# EAGLE design analog_out (EAGLE 9.6.1)
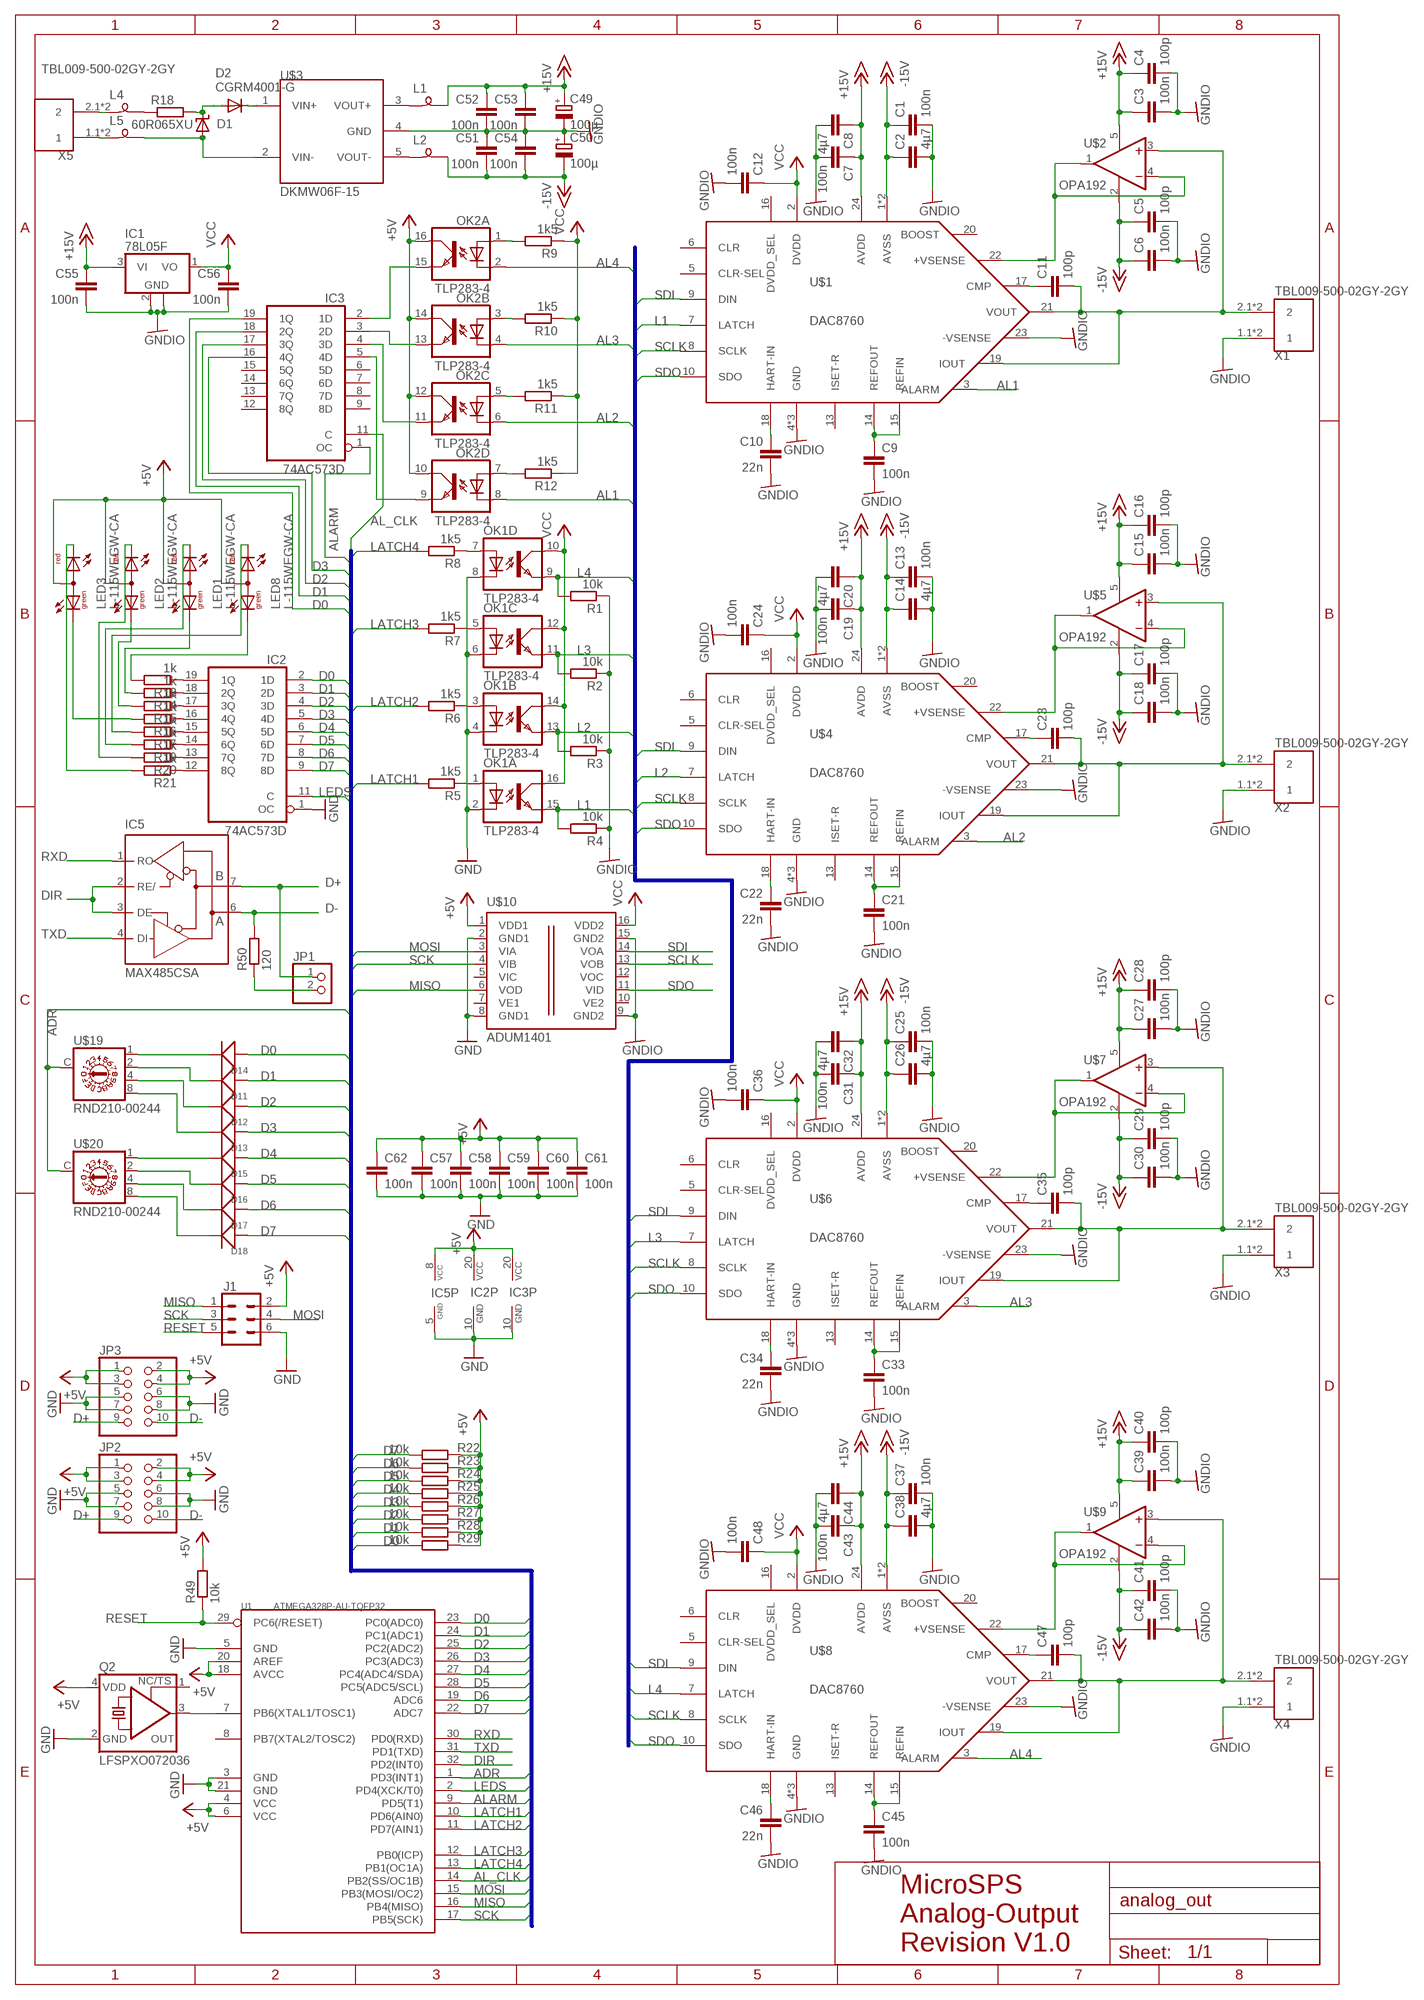
[diagram p0: schematic, sheet 1]

## Parts
C1  100n  C-EUC0805  [C0805]
C2  4µ7  C-EUC0805  [C0805]
C3  100n  C-EUC0805  [C0805]
C4  100p  C-EUC0805  [C0805]
C5  100p  C-EUC0805  [C0805]
C6  100n  C-EUC0805  [C0805]
C7  100n  C-EUC0805  [C0805]
C8  4µ7  C-EUC0805  [C0805]
C9  100n  C-EUC0805  [C0805]
C10  22n  C-EUC0805  [C0805]
C11  100p  C-EUC0805  [C0805]
C12  100n  C-EUC0805  [C0805]
C13  100n  C-EUC0805  [C0805]
C14  4µ7  C-EUC0805  [C0805]
C15  100n  C-EUC0805  [C0805]
C16  100p  C-EUC0805  [C0805]
C17  100p  C-EUC0805  [C0805]
C18  100n  C-EUC0805  [C0805]
C19  100n  C-EUC0805  [C0805]
C20  4µ7  C-EUC0805  [C0805]
C21  100n  C-EUC0805  [C0805]
C22  22n  C-EUC0805  [C0805]
C23  100p  C-EUC0805  [C0805]
C24  100n  C-EUC0805  [C0805]
C25  100n  C-EUC0805  [C0805]
C26  4µ7  C-EUC0805  [C0805]
C27  100n  C-EUC0805  [C0805]
C28  100p  C-EUC0805  [C0805]
C29  100p  C-EUC0805  [C0805]
C30  100n  C-EUC0805  [C0805]
C31  100n  C-EUC0805  [C0805]
C32  4µ7  C-EUC0805  [C0805]
C33  100n  C-EUC0805  [C0805]
C34  22n  C-EUC0805  [C0805]
C35  100p  C-EUC0805  [C0805]
C36  100n  C-EUC0805  [C0805]
C37  100n  C-EUC0805  [C0805]
C38  4µ7  C-EUC0805  [C0805]
C39  100n  C-EUC0805  [C0805]
C40  100p  C-EUC0805  [C0805]
C41  100p  C-EUC0805  [C0805]
C42  100n  C-EUC0805  [C0805]
C43  100n  C-EUC0805  [C0805]
C44  4µ7  C-EUC0805  [C0805]
C45  100n  C-EUC0805  [C0805]
C46  22n  C-EUC0805  [C0805]
C47  100p  C-EUC0805  [C0805]
C48  100n  C-EUC0805  [C0805]
C49  100µ  CPOL-EU153CLV-0505  [153CLV-0505]
C50  100µ  CPOL-EU153CLV-0505  [153CLV-0505]
C51  100n  C-EUC0805  [C0805]
C52  100n  C-EUC0805  [C0805]
C53  100n  C-EUC0805  [C0805]
C54  100n  C-EUC0805  [C0805]
C55  100n  C-EUC0805  [C0805]
C56  100n  C-EUC0805  [C0805]
C57  100n  C-EUC0805  [C0805]
C58  100n  C-EUC0805  [C0805]
C59  100n  C-EUC0805  [C0805]
C60  100n  C-EUC0805  [C0805]
C61  100n  C-EUC0805  [C0805]
C62  100n  C-EUC0805  [C0805]
D1  SUPPRESSOR-SMBJ  [SMBJ]
D2  CGRM4001-G  [SOD-123_MINI-SMA]
D11  DIODE'1N4148-SMD'  [LL-34]
D12  DIODE'1N4148-SMD'  [LL-34]
D13  DIODE'1N4148-SMD'  [LL-34]
D14  DIODE'1N4148-SMD'  [LL-34]
D15  DIODE'1N4148-SMD'  [LL-34]
D16  DIODE'1N4148-SMD'  [LL-34]
D17  DIODE'1N4148-SMD'  [LL-34]
D18  DIODE'1N4148-SMD'  [LL-34]
IC1  78L05F  [SOT89]
IC2  74AC573D  [SO20W]
IC3  74AC573D  [SO20W]
IC5  MAX485CSA  MAX481CSA  [SO08]
J1  CONN_03X2FEMALE_SMD  [2X3_SMD]
JP1  PINHD-1X2  [1X02]
JP2  PINHD-2X5/90  [2X05/90]
JP3  PINHD-2X5/90  [2X05/90]
L1  SM-B5  [SM-B5]
L2  SM-B5  [SM-B5]
L4  SM-B5  [SM-B5]
L5  SM-B5  [SM-B5]
LED1  L-115WEGW-CA  [DUOLED-A-3MM]
LED2  L-115WEGW-CA  [DUOLED-A-3MM]
LED3  L-115WEGW-CA  [DUOLED-A-3MM]
LED8  L-115WEGW-CA  [DUOLED-A-3MM]
OK1  TLP283-4  [MINI-FLAT-16]
OK2  TLP283-4  [MINI-FLAT-16]
Q2  LFSPXO072036  KXO-PXO/XO-56-56  [5.0X3.2_KXO-56]
R1  10k  R-EU_R0805  [R0805]
R2  10k  R-EU_R0805  [R0805]
R3  10k  R-EU_R0805  [R0805]
R4  10k  R-EU_R0805  [R0805]
R5  1k5  R-EU_R0805  [R0805]
R6  1k5  R-EU_R0805  [R0805]
R7  1k5  R-EU_R0805  [R0805]
R8  1k5  R-EU_R0805  [R0805]
R9  1k5  R-EU_R0805  [R0805]
R10  1k5  R-EU_R0805  [R0805]
R11  1k5  R-EU_R0805  [R0805]
R12  1k5  R-EU_R0805  [R0805]
R13  1k  R-EU_R0805  [R0805]
R14  1k  R-EU_R0805  [R0805]
R15  1k  R-EU_R0805  [R0805]
R16  1k  R-EU_R0805  [R0805]
R17  1k  R-EU_R0805  [R0805]
R18  60R065XU  R-EU_0204/5  [0204/5]
R19  1k  R-EU_R0805  [R0805]
R20  1k  R-EU_R0805  [R0805]
R21  1k  R-EU_R0805  [R0805]
R22  10k  R-EU_R0805  [R0805]
R23  10k  R-EU_R0805  [R0805]
R24  10k  R-EU_R0805  [R0805]
R25  10k  R-EU_R0805  [R0805]
R26  10k  R-EU_R0805  [R0805]
R27  10k  R-EU_R0805  [R0805]
R28  10k  R-EU_R0805  [R0805]
R29  10k  R-EU_R0805  [R0805]
R49  10k  R-EU_R0805  [R0805]
R50  120  R-EU_R0805  [R0805]
U1  ATMEGA328P-AU-TQFP32  MCU-ATMEGA328P-AU(TQFP32)  [TQFP32-0.8-7X7MM]
U$1  DAC8760  [HTSSOP24PWP]
U$2  OPA192  [SOT23-DBV]
U$3  DKMW06F-15  [DKWM06]
U$4  DAC8760  [HTSSOP24PWP]
U$5  OPA192  [SOT23-DBV]
U$6  DAC8760  [HTSSOP24PWP]
U$7  OPA192  [SOT23-DBV]
U$8  DAC8760  [HTSSOP24PWP]
U$9  OPA192  [SOT23-DBV]
U$10  ADUM1401  [SO-16W]
U$19  RND210-00244  [RND210-00244]
U$20  RND210-00244  [RND210-00244]
X1  TBL009-500-02GY-2GY  [TBL009-500-02GY-2GY]
X2  TBL009-500-02GY-2GY  [TBL009-500-02GY-2GY]
X3  TBL009-500-02GY-2GY  [TBL009-500-02GY-2GY]
X4  TBL009-500-02GY-2GY  [TBL009-500-02GY-2GY]
X5  TBL009-500-02GY-2GY  [TBL009-500-02GY-2GY]

## Nets
+5V: C57.1 C58.1 C59.1 C60.1 C61.1 C62.1 IC2.20(VCC) IC3.20(VCC) IC5.8(VCC) J1.2 JP2.1 JP2.2 JP2.3 JP2.4 JP3.1 JP3.2 JP3.3 JP3.4 LED1.2(A) LED2.2(A) LED3.2(A) LED8.2(A) OK2.10(D:COL) OK2.12(C:COL) OK2.14(B:COL) OK2.16(A:COL) Q2.4(VDD) R22.1 R23.1 R24.1 R25.1 R26.1 R27.1 R28.1 R29.1 R49.2 U1.4(VCC) U1.6(VCC) U1.18(AVCC) U1.20(AREF) U$10.1(VDD1)
+15V: C3.1 C4.1 C7.1 C8.1 C15.1 C16.1 C19.1 C20.1 C27.1 C28.1 C31.1 C32.1 C39.1 C40.1 C43.1 C44.1 C49.+ C52.1 C53.1 C55.1 IC1.3(VI) L1.1 U$1.24(AVDD) U$2.5(V+) U$4.24(AVDD) U$5.5(V+) U$6.24(AVDD) U$7.5(V+) U$8.24(AVDD) U$9.5(V+)
-15V: C1.1 C2.1 C5.1 C6.1 C13.1 C14.1 C17.1 C18.1 C25.1 C26.1 C29.1 C30.1 C37.1 C38.1 C41.1 C42.1 C50.- C51.2 C54.2 L2.1 U$1.1(AVSS) U$1.EXP(AVSS) U$2.2(V-) U$4.1(AVSS) U$4.EXP(AVSS) U$5.2(V-) U$6.1(AVSS) U$6.EXP(AVSS) U$7.2(V-) U$8.1(AVSS) U$8.EXP(AVSS) U$9.2(V-)
ADR: U1.1(PD3(INT1)) U$19.C U$20.C
AL1: OK2.8(D:C) U$1.3(ALARM)
AL2: OK2.6(C:C) U$4.3(ALARM)
AL3: OK2.4(B:C) U$6.3(ALARM)
AL4: OK2.2(A:C) U$8.3(ALARM)
AL_CLK: IC3.11(C) U1.14(PB2(SS/OC1B))
ALARM: IC3.1(OC) U1.9(PD5(T1))
D0: D14.A(+) IC2.2(1D) IC3.19(1Q) R29.2 U1.23(PC0(ADC0))
D1: D11.A(+) IC2.3(2D) IC3.18(2Q) R28.2 U1.24(PC1(ADC1))
D2: D12.A(+) IC2.4(3D) IC3.17(3Q) R27.2 U1.25(PC2(ADC2))
D3: D13.A(+) IC2.5(4D) IC3.16(4Q) R26.2 U1.26(PC3(ADC3))
D4: D15.A(+) IC2.6(5D) R25.2 U1.27(PC4(ADC4/SDA))
D5: D16.A(+) IC2.7(6D) R24.2 U1.28(PC5(ADC5/SCL))
D6: D17.A(+) IC2.8(7D) R23.2 U1.19(ADC6)
D7: D18.A(+) IC2.9(8D) R22.2 U1.22(ADC7)
D+: IC5.7(B) JP1.1 JP2.9 JP3.9
D-: IC5.6(A) JP2.10 JP3.10 R50.2
DIR: IC5.2(RE/) IC5.3(DE) U1.32(PD2(INT0))
GND: C57.2 C58.2 C59.2 C60.2 C61.2 C62.2 IC2.1(OC) IC2.10(GND) IC3.10(GND) IC5.5(GND) J1.6 JP2.5 JP2.6 JP2.7 JP2.8 JP3.5 JP3.6 JP3.7 JP3.8 OK1.2(A:C) OK1.4(B:C) OK1.6(C:C) OK1.8(D:C) Q2.2(GND) U1.3(GND) U1.5(GND) U1.21(GND) U$10.2(GND1) U$10.8(GND1)
GNDIO: C1.2 C2.2 C3.2 C4.2 C5.2 C6.2 C7.2 C8.2 C9.2 C10.2 C12.2 C13.2 C14.2 C15.2 C16.2 C17.2 C18.2 C19.2 C20.2 C21.2 C22.2 C24.2 C25.2 C26.2 C27.2 C28.2 C29.2 C30.2 C31.2 C32.2 C33.2 C34.2 C36.2 C37.2 C38.2 C39.2 C40.2 C41.2 C42.2 C43.2 C44.2 C45.2 C46.2 C48.2 C49.- C50.+ C51.1 C52.2 C53.2 C54.1 C55.2 C56.2 IC1.2(GND) IC1.2@1(GND) R1.1 R2.1 R3.1 R4.1 U$1.4(GND) U$1.11(GND) U$1.12(GND) U$1.23(-VSENSE) U$3.4(GND) U$4.4(GND) U$4.11(GND) U$4.12(GND) U$4.23(-VSENSE) U$6.4(GND) U$6.11(GND) U$6.12(GND) U$6.23(-VSENSE) U$8.4(GND) U$8.11(GND) U$8.12(GND) U$8.23(-VSENSE) U$10.9(GND2) U$10.15(GND2) X1.1.1 X1.1.2 X2.1.1 X2.1.2 X3.1.1 X3.1.2 X4.1.1 X4.1.2
L1: OK1.15(A:EMIT) R4.2 U$1.7(LATCH)
L2: OK1.13(B:EMIT) R3.2 U$4.7(LATCH)
L3: OK1.11(C:EMIT) R2.2 U$6.7(LATCH)
L4: OK1.9(D:EMIT) R1.2 U$8.7(LATCH)
LATCH1: R5.2 U1.10(PD6(AIN0))
LATCH2: R6.2 U1.11(PD7(AIN1))
LATCH3: R7.2 U1.12(PB0(ICP))
LATCH4: R8.2 U1.13(PB1(OC1A))
LEDS: IC2.11(C) U1.2(PD4(XCK/T0))
MISO: J1.1 U1.16(PB4(MISO)) U$10.6(VOD)
MOSI: J1.4 U1.15(PB3(MOSI/OC2)) U$10.3(VIA)
N$1: C9.1 U$1.14(REFOUT) U$1.15(REFIN)
N$2: C10.1 U$1.18(HART-IN)
N$3: C11.1 U$1.17(CMP)
N$4: C23.2 U$4.19(IOUT) U$4.21(VOUT) U$5.3(+IN) X2.2.1 X2.2.2
N$5: C11.2 U$1.19(IOUT) U$1.21(VOUT) U$2.3(+IN) X1.2.1 X1.2.2
N$6: U$1.22(+VSENSE) U$2.1(OUT) U$2.4(-IN)
N$7: U$4.22(+VSENSE) U$5.1(OUT) U$5.4(-IN)
N$8: C21.1 U$4.14(REFOUT) U$4.15(REFIN)
N$9: C22.1 U$4.18(HART-IN)
N$10: C23.1 U$4.17(CMP)
N$11: C35.2 U$6.19(IOUT) U$6.21(VOUT) U$7.3(+IN) X3.2.1 X3.2.2
N$12: U$6.22(+VSENSE) U$7.1(OUT) U$7.4(-IN)
N$13: C33.1 U$6.14(REFOUT) U$6.15(REFIN)
N$14: C34.1 U$6.18(HART-IN)
N$15: C35.1 U$6.17(CMP)
N$16: C47.2 U$8.19(IOUT) U$8.21(VOUT) U$9.3(+IN) X4.2.1 X4.2.2
N$17: U$8.22(+VSENSE) U$9.1(OUT) U$9.4(-IN)
N$18: C45.1 U$8.14(REFOUT) U$8.15(REFIN)
N$19: C46.1 U$8.18(HART-IN)
N$20: C47.1 U$8.17(CMP)
N$21: L4.2 X5.2.1 X5.2.2
N$22: L5.2 X5.1.1 X5.1.2
N$23: L4.1 R18.1
N$24: D1.C D2.A R18.2
N$25: D1.A L5.1 U$3.2(VIN-)
N$26: D2.C U$3.1(VIN+)
N$27: L1.2 U$3.3(VOUT+)
N$28: L2.2 U$3.5(VOUT-)
N$29: IC2.19(1Q) R13.1
N$30: IC2.18(2Q) R14.1
N$31: IC2.17(3Q) R15.1
N$32: IC2.16(4Q) R16.1
N$33: OK2.1(A:A) R9.2
N$34: OK1.1(A:A) R5.1
N$35: OK1.3(B:A) R6.1
N$36: OK1.5(C:A) R7.1
N$37: OK1.7(D:A) R8.1
N$38: OK2.3(B:A) R10.2
N$39: OK2.5(C:A) R11.2
N$40: OK2.7(D:A) R12.2
N$41: IC2.15(5Q) R17.1
N$42: IC2.14(6Q) R19.1
N$43: IC2.13(7Q) R20.1
N$44: IC2.12(8Q) R21.1
N$45: LED8.1(CG) R13.2
N$46: LED1.1(CG) R14.2
N$47: LED2.1(CG) R15.2
N$48: LED3.1(CG) R16.2
N$49: LED8.3(CR) R17.2
N$50: LED1.3(CR) R19.2
N$51: LED2.3(CR) R20.2
N$52: LED3.3(CR) R21.2
N$53: IC3.5(4D) OK2.9(D:EMIT)
N$54: IC3.4(3D) OK2.11(C:EMIT)
N$55: IC3.3(2D) OK2.13(B:EMIT)
N$56: IC3.2(1D) OK2.15(A:EMIT)
N$97: Q2.3(OUT) U1.7(PB6(XTAL1/TOSC1))
N$99: JP1.2 R50.1
N$100: D14.C(-) U$19.1
N$101: D11.C(-) U$19.2
N$102: D12.C(-) U$19.4
N$103: D13.C(-) U$19.8
N$104: D15.C(-) U$20.1
N$105: D16.C(-) U$20.2
N$106: D17.C(-) U$20.4
N$107: D18.C(-) U$20.8
RESET: J1.5 R49.1 U1.29(PC6(/RESET))
RXD: IC5.1(RO) U1.30(PD0(RXD))
SCK: J1.3 U1.17(PB5(SCK)) U$10.4(VIB)
SCLK: U$1.8(SCLK) U$4.8(SCLK) U$6.8(SCLK) U$8.8(SCLK) U$10.13(VOB)
SDI: U$1.9(DIN) U$4.9(DIN) U$6.9(DIN) U$8.9(DIN) U$10.14(VOA)
SDO: U$1.10(SDO) U$4.10(SDO) U$6.10(SDO) U$8.10(SDO) U$10.11(VID)
TXD: IC5.4(DI) U1.31(PD1(TXD))
VCC: C12.1 C24.1 C36.1 C48.1 C56.1 IC1.1(VO) OK1.10(D:COL) OK1.12(C:COL) OK1.14(B:COL) OK1.16(A:COL) R9.1 R10.1 R11.1 R12.1 U$1.2(DVDD) U$4.2(DVDD) U$6.2(DVDD) U$8.2(DVDD) U$10.16(VDD2)
Unconnected: IC3.6(5D) IC3.7(6D) IC3.8(7D) IC3.9(8D) IC3.12(8Q) IC3.13(7Q) IC3.14(6Q) IC3.15(5Q) Q2.1(TS) U1.8(PB7(XTAL2/TOSC2)) U$1.5(CLR-SEL) U$1.6(CLR) U$1.13(ISET-R) U$1.16(DVDD_SEL) U$1.20(BOOST) U$4.5(CLR-SEL) U$4.6(CLR) U$4.13(ISET-R) U$4.16(DVDD_SEL) U$4.20(BOOST) U$6.5(CLR-SEL) U$6.6(CLR) U$6.13(ISET-R) U$6.16(DVDD_SEL) U$6.20(BOOST) U$8.5(CLR-SEL) U$8.6(CLR) U$8.13(ISET-R) U$8.16(DVDD_SEL) U$8.20(BOOST) U$10.5(VIC) U$10.7(VE1) U$10.10(VE2) U$10.12(VOC)

## Buses
ADR,ALARM,AL_CLK,D0,D1,D2,D3,D4,D5,D6,D7,LATCH1,LATCH2,LATCH3,LATCH4,LEDS,MISO,MOSI,SCK
AL1,AL2,AL3,AL4,L1,L2,L3,L4,SCLK,SDI,SDO

## Notes on the sheet
- MicroSPS
  Analog-Output
  Revision V1.0

## Library data of the parts
C1-C48 C51-C62 = rcl:C-EU: CAPACITOR, European symbol; SPICEPREFIX: C
C49 C50 = rcl:CPOL-EU: POLARIZED CAPACITOR, European symbol; SPICEPREFIX: C
D1 = diode:SUPPRESSOR-: Suppressor diode
D2 = diode:CGRM400*-G: Molded plasitc,JEDEC SOD-123/Mini SMA Source: Comchip CGRM4001-G.pdf
D11-D18 = Seeed-OPL-Diode:DIODE*
IC1 = linear:78L*: POSITOIV-VOLTAGE REGULATORS Output up to 100 mA Source: Datasheet <http://focus.ti.com/lit/ds/symlink/ua78l05.pdf>
IC2 IC3 = 74xx-eu:74*573: 8-bit D latch BUS DRIVER
IC5 = maxim:MAX481CSA: RS485 TRANSEIVER; MF: MAXIM; MPN: MAX481CSA; OC_FARNELL: unknown; OC_NEWARK: 90C3817
J1 = SparkFun-Connectors:CONN_03X2: Multi connection point. Often used as Generic Header-pin footprint for 0.1 inch spaced/style header connections You can populate with any combo of single row headers, but if you'd like an exact match, check these: Header - 2x3 (Male, 0.1") <https://www.sparkfun.com/products/12807> (PRT-12807) Header - 2x3 (Female, 0.1") <https://www.sparkfun.com/products/13010> (PRT-13010) 2x3 Pin Shrouded Header <https://www.sparkfun.com/products/10877> (PRT-10877) On any of the 0.1 inch spaced packages, you can populate with these: Break Away Headers - Straight <https://www.sparkfun.com/products/116> (PRT-00116) Break Away Male Headers - Right Angle <https://www.sparkfun.com/products/553> (PRT-00553) Female Headers <https://www.sparkfun.com/products/115> (PRT-00115) Break Away Headers - Machine Pin <https://www.sparkfun.com/products/117> (PRT-00117) Break Away Female Headers - Swiss Machine Pin <https://www.sparkfun.com/products/743> (PRT-00743) Special note: the shrouded connector mates well with our 3x2 ribbon cables: Ribbon Crimp Connector - 6-pin (2x3, Female) <https://www.sparkfun.com/products/10651> (PRT-10651) Ribbon Cable - 6 wire (15ft) <https://www.sparkfun.com/products/10646> (PRT-10646); PROD_ID: CONN-11290
JP1 = pinhead:PINHD-1X2: PIN HEADER
JP2 JP3 = pinhead:PINHD-2X5: PIN HEADER
L1 L2 L4 L5 = inductor-neosid:SM-B: INDUCTOR SMD Bead inductor; OC_FARNELL: unknown; OC_NEWARK: unknown
LED1-LED3 LED8 = led:L-115WEGW-CA: T-1(3mm) BI-COLOR INDICATOR LAMP Source: Kingbright .. 2_colour_led_.pdf
OK1 OK2 = optocoupler:TLP283-4: TOSHIBA PHOTOCOUPLER GaAs IRED & PHOTO-TRANSISTOR Source: http://www.semicon.toshiba.co.jp/td/en/Opto/Photocoupler/en_20050928_TLP283_datasheet.pdf; OC_FARNELL: unknown; OC_NEWARK: unknown
Q2 = crystal-geyer_V1_0:KXO-PXO/XO-56: SSO Spread Spectrum Oscillator (PXO/XO) MHz : KXO - Serie Model Size l/w/h [mm] Frequency Range Frequency Stability Temp. Range [°C] Output AECQ 200 availabel Datasheet KXO-56 5.0/3.2/1.2 1,0 ~ 134,0 MHz ±25 … ±100ppm (*) -40°C …+85°C HCMOS - KXO-56.pdf <http://www.geyer-electronic.de/uploads/tx_userartikelfrequenz/GEYER-KXO-56.pdf> <http://www.geyer-electronic.de/fileadmin/template/img/logo-geyer-electronic.png> Details see: http://www.geyer-electronic.de/Frequenz-Produkte.9.0.html Created 2016-06-07, Hans Locher 2016 (C) Geyer Quartz Technology KXO56;5,0x3,2;5.0x3.2;5032
R1-R29 R49 R50 = rcl:R-EU_: RESISTOR, European symbol; SPICEPREFIX: R
U1 = Seeed-OPL-ic:MCU-ATMEGA328P-AU(TQFP32): 310010049; MPN: ATMEGA328P-AU
U$1 U$4 U$6 U$8 = texas:DAC8760
U$2 U$5 U$7 U$9 = texas:OPA192
U$3 = meanwell:DKMW06F-15
U$10 = analog-devices:ADUM1401
U$19 U$20 = switch-dil:RND210-00244
X1-X5 = con-phoenix-500:TBL009-500-02GY-2GY

## Board
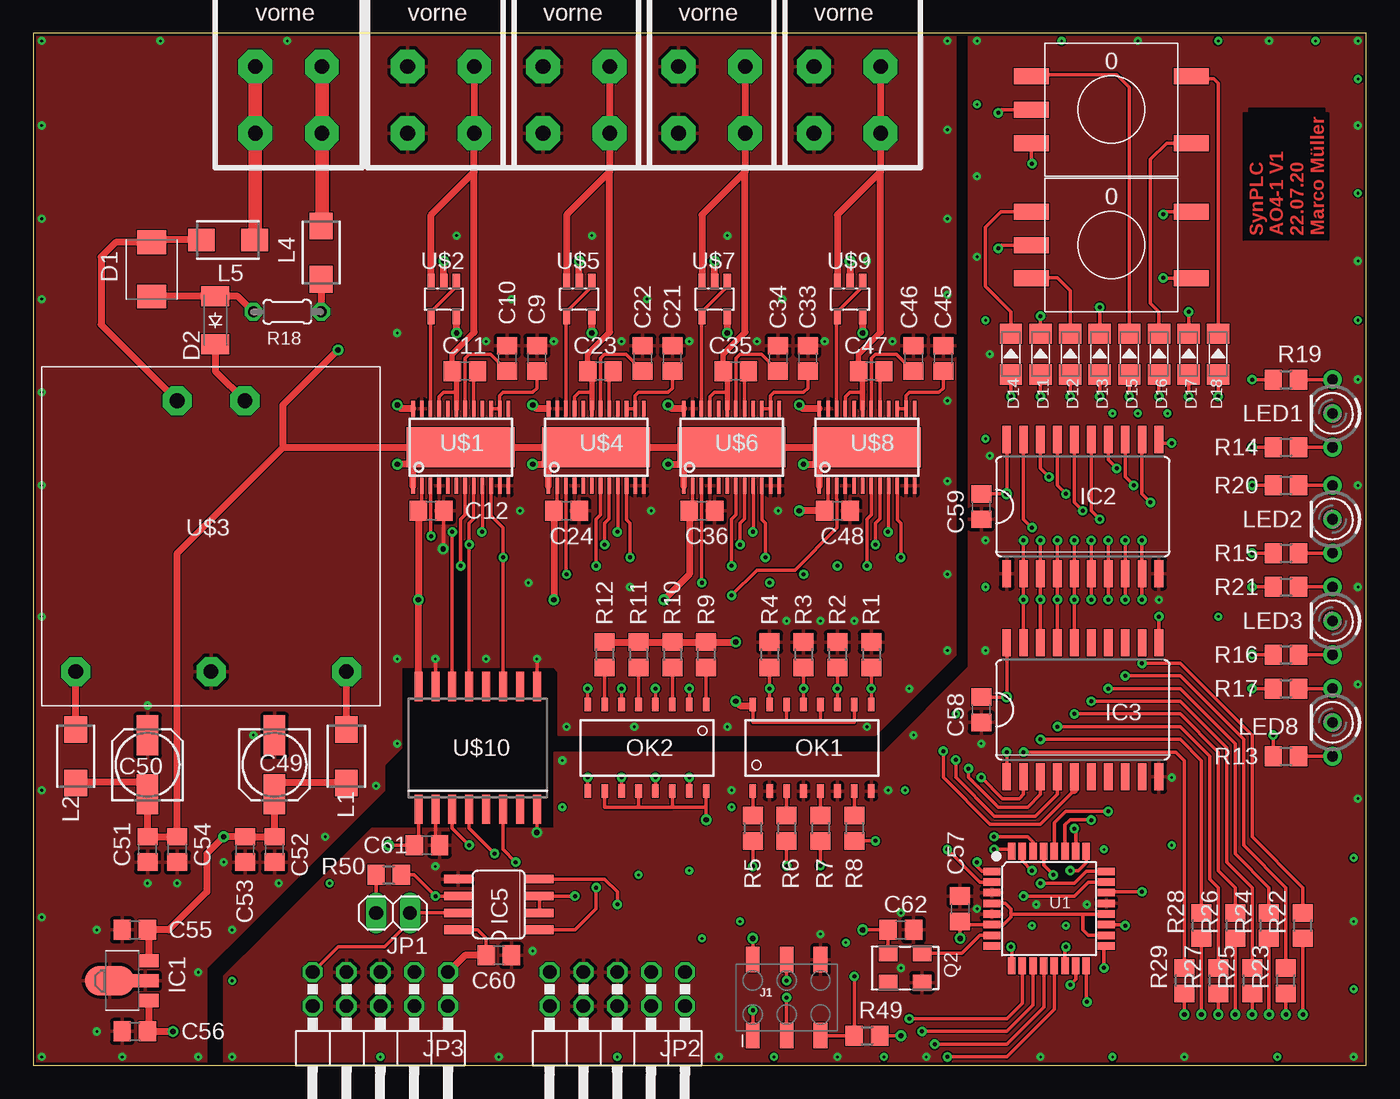
[diagram p1: board, top side]
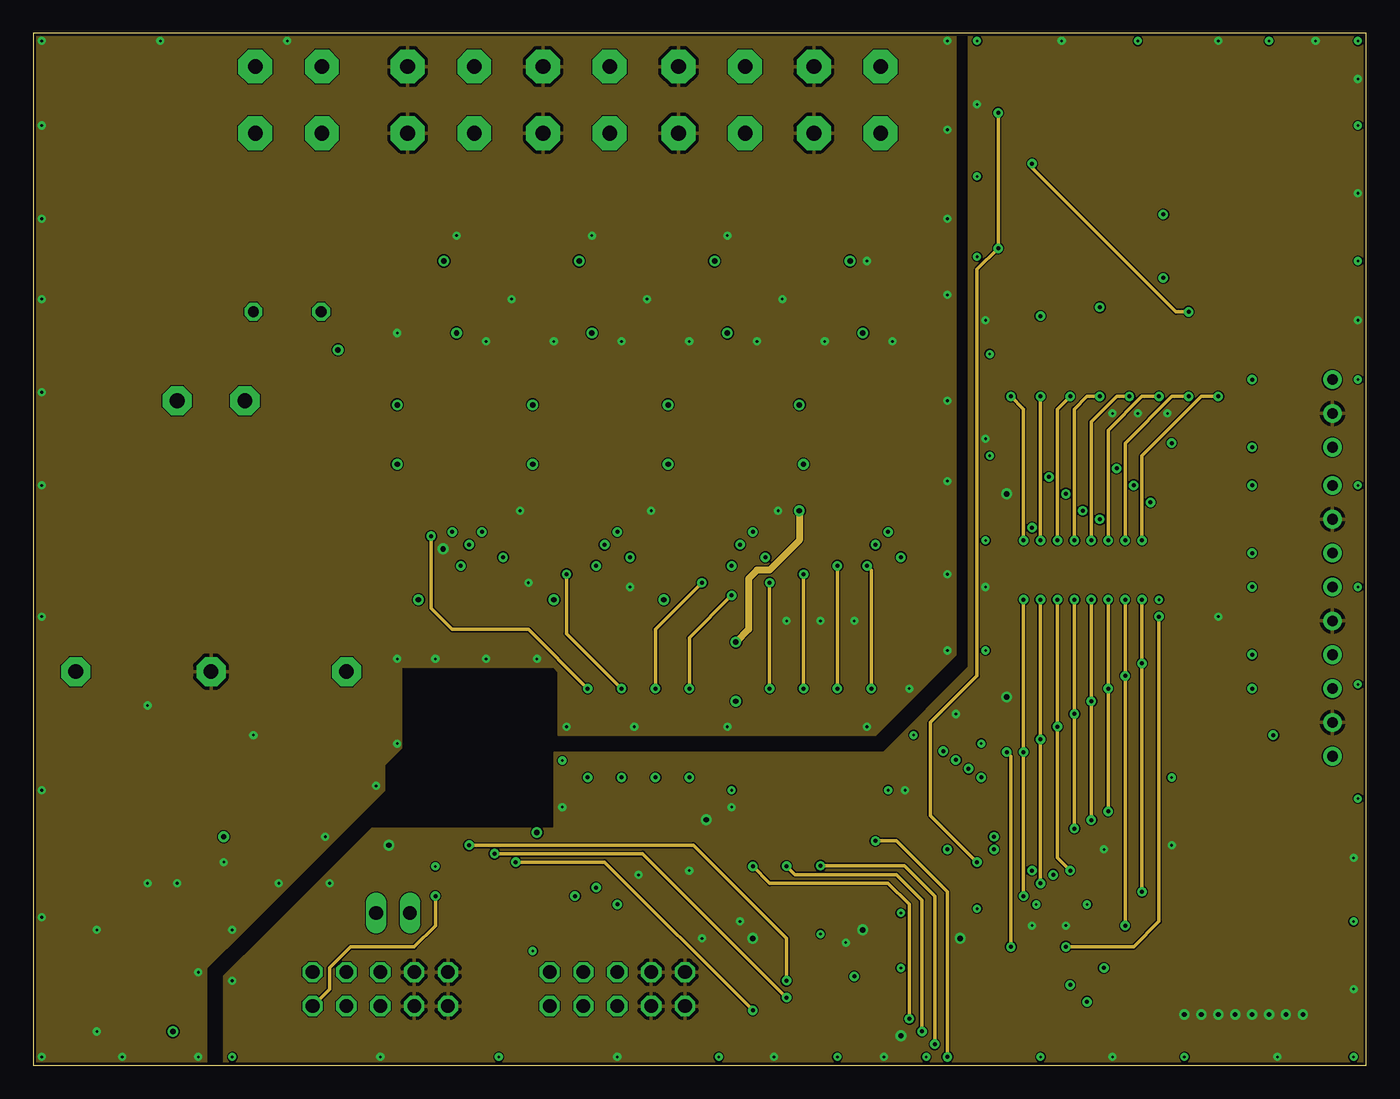
[diagram p2: board, inner layer Route2]
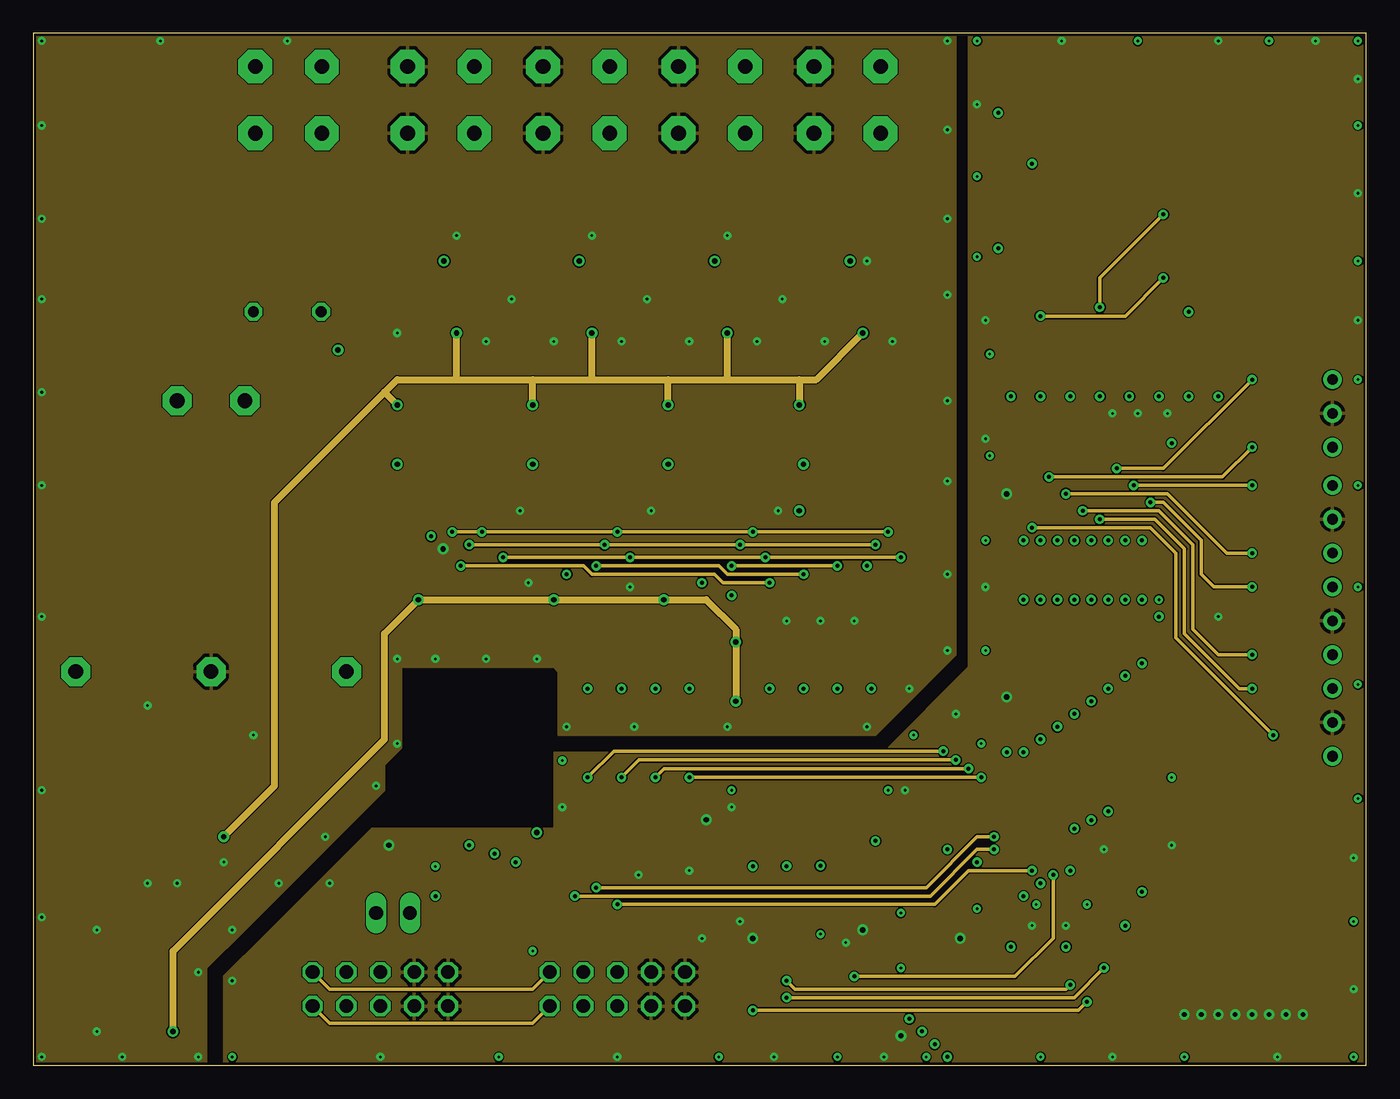
[diagram p3: board, inner layer Route15]
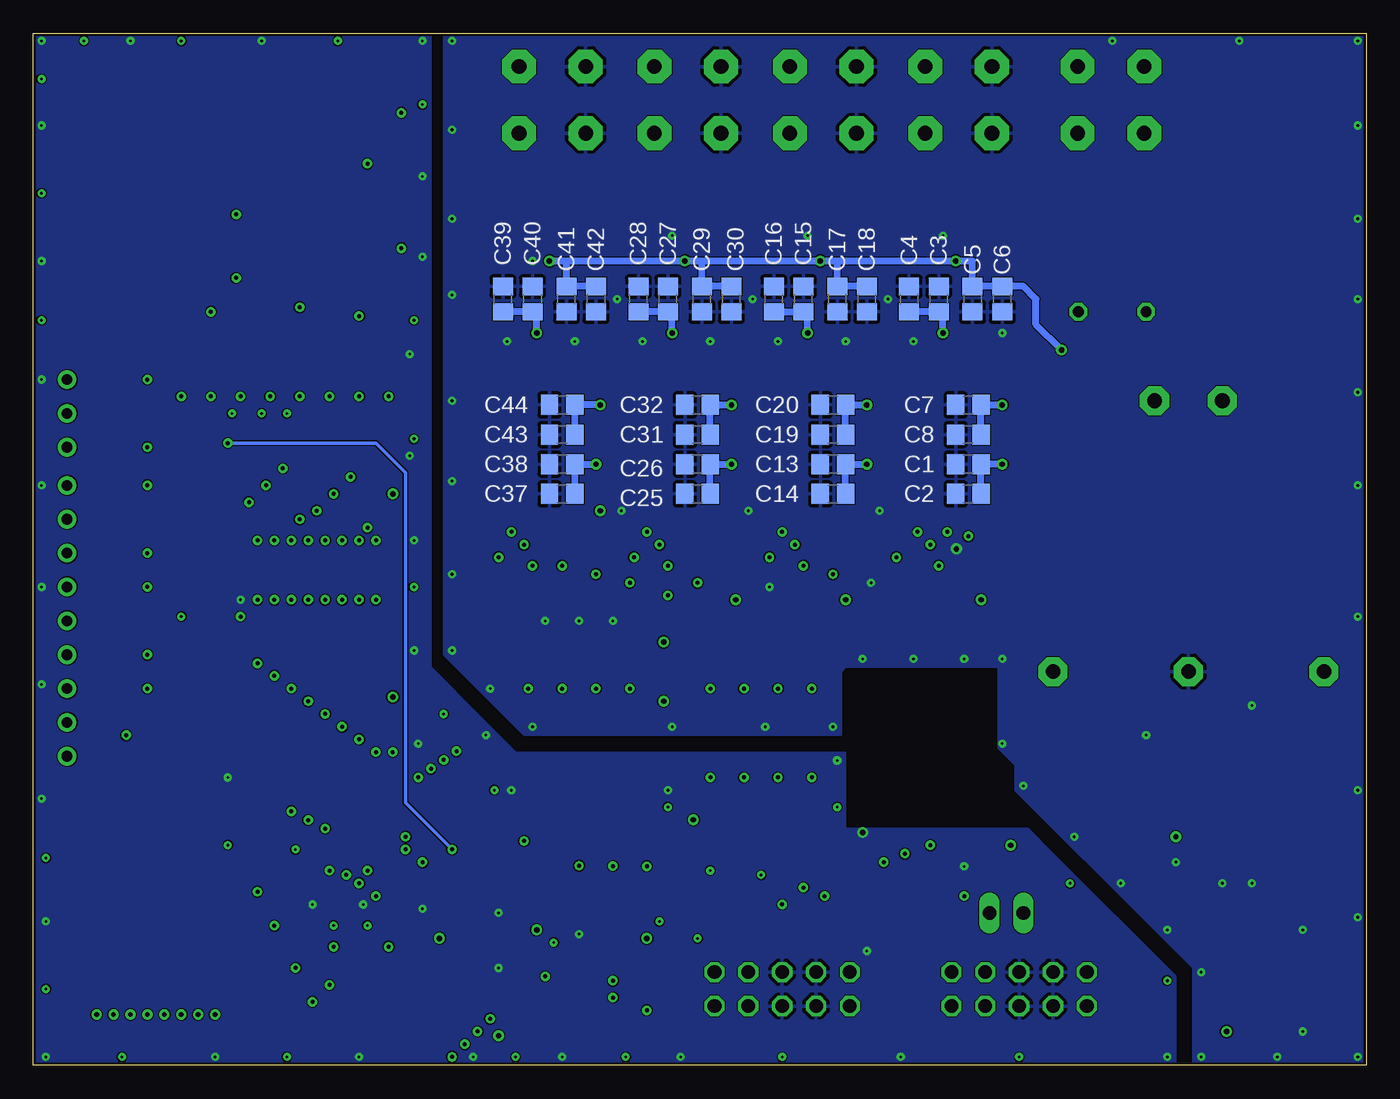
[diagram p4: board, bottom side, seen from below]

Size 100 x 77.4 mm. Coordinates in mm from the lower left corner, seen from the top.
Outline: 0,0 100,0 100,77.4 0,77.4 0,0
Copper layers (1+2*15+16): Top 0.035mm / dielectric 0.2mm / Route2 0.035mm / dielectric 1mm / Route15 0.035mm / dielectric 0.2mm / Bottom 0.035mm
Design rules "jlc *": minimum track width 3.5mil, minimum drill 0.2mm, track to track 3.5mil, track to pad 6mil, pad to pad 6mil, via to via 6mil, smd to smd 6mil, copper to edge 0.2mm, drill to drill 6mil, minimum pad ring 10mil, minimum via ring 8mil, stop-mask expansion 4mil, vias tented up to drill 0mil, thermal gap 10mil
tRestrict: 4 lines

### Footprints (pad centres in the part's own frame; a part is rotated, then mirrored left to right if it is on the bottom)
C0805 = smd 1.3 x 1.5: 1 -0.95,0; 2 0.95,0
153CLV-0505 = smd 3 x 1.6: + 2.2,0; - -2.2,0
SMBJ = smd 1.78 x 2.16: A 2.04,0; C -2.03,0
SOD-123_MINI-SMA = smd 1.5 x 2.1: A 1.8,0; C -1.8,0
LL-34 = smd 1.524 x 1.676: A -1.524,0; C 1.524,0
SOT89 = smd 1 x 1.5: 1 -1.499,-1.981; 3 1.499,-1.981 | smd 1 x 2: 2 0,-1.727 | smd 2.2 x 3.7: 2@1 0,0.94
SO20W = smd 0.66 x 2.032: 1 -5.715,-5.029; 2 -4.445,-5.029; 3 -3.175,-5.029; 4 -1.905,-5.029; 5 -0.635,-5.029; 6 0.635,-5.029; 7 1.905,-5.029; 8 3.175,-5.029; 9 4.445,-5.029; 10 5.715,-5.029; 11 5.715,5.029; 12 4.445,5.029; 13 3.175,5.029; 14 1.905,5.029; 15 0.635,5.029; 16 -0.635,5.029; 17 -1.905,5.029; 18 -3.175,5.029; 19 -4.445,5.029; 20 -5.715,5.029
SO08 = smd 0.66 x 2.032: 1 -1.905,-3.073; 2 -0.635,-3.073; 3 0.635,-3.073; 4 1.905,-3.073; 5 1.905,3.073; 6 0.635,3.073; 7 -0.635,3.073; 8 -1.905,3.073
2X3_SMD = smd 1.02 x 1.9: 1 -2.54,-2.85; 2 -2.54,2.85; 3 0,-2.85; 4 0,2.85; 5 2.54,-2.85; 6 2.54,2.85
1X02 = drill 1.016 long: 1 -1.27,0; 2 1.27,0
2X05/90 = drill 1.016 octagon: 1 -5.08,-6.35; 2 -5.08,-3.81; 3 -2.54,-6.35; 4 -2.54,-3.81; 5 0,-6.35; 6 0,-3.81; 7 2.54,-6.35; 8 2.54,-3.81; 9 5.08,-6.35; 10 5.08,-3.81
SM-B5 = smd 2 x 1.7: 1 -2,0; 2 2,0
DUOLED-A-3MM = drill 0.8 pad 1.4: 1 -2.54,0; 2 0,0; 3 2.54,0
MINI-FLAT-16 = smd 1 x 0.5: 1 -3.24,4.445; 2 -3.24,3.175; 3 -3.24,1.905; 4 -3.24,0.635; 5 -3.24,-0.635; 6 -3.24,-1.905; 7 -3.24,-3.175; 8 -3.24,-4.445; 9 3.24,-4.445; 10 3.24,-3.175; 11 3.24,-1.905; 12 3.24,-0.635; 13 3.24,0.635; 14 3.24,1.905; 15 3.24,3.175; 16 3.24,4.445
5.0X3.2_KXO-56 = smd 1.4 x 1.2: 1 -1.27,-1.1; 2 1.27,-1.1; 3 1.27,1.1; 4 -1.27,1.1
R0805 = smd 1.3 x 1.5: 1 -0.95,0; 2 0.95,0
0204/5 = drill 0.813 octagon: 1 -2.54,0; 2 2.54,0
TQFP32-0.8-7X7MM = smd 1.27 x 0.559: 1 -4.293,2.8; 2 -4.293,2; 3 -4.293,1.2; 4 -4.293,0.4; 5 -4.293,-0.4; 6 -4.293,-1.2; 7 -4.293,-2; 8 -4.293,-2.8; 17 4.293,-2.8; 18 4.293,-2; 19 4.293,-1.2; 20 4.293,-0.4; 21 4.293,0.4; 22 4.293,1.2; 23 4.293,2; 24 4.293,2.8 | smd 0.559 x 1.27: 9 -2.8,-4.293; 10 -2,-4.293; 11 -1.2,-4.293; 12 -0.4,-4.293; 13 0.4,-4.293; 14 1.2,-4.293; 15 2,-4.293; 16 2.8,-4.293; 25 2.8,4.293; 26 2,4.293; 27 1.2,4.293; 28 0.4,4.293; 29 -0.4,4.293; 30 -1.2,4.293; 31 -2,4.293; 32 -2.8,4.293
HTSSOP24PWP = smd 0.27 x 1.2: 1 -3.576,-2.902; 2 -2.925,-2.9; 3 -2.275,-2.9; 4 -1.625,-2.9; 5 -0.975,-2.9; 6 -0.325,-2.9; 7 0.325,-2.9; 8 0.975,-2.9; 9 1.625,-2.9; 10 2.275,-2.9; 11 2.925,-2.9; 12 3.573,-2.899; 13 3.575,2.899; 14 2.925,2.9; 15 2.275,2.9; 16 1.625,2.9; 17 0.975,2.9; 18 0.325,2.9; 19 -0.325,2.9; 20 -0.975,2.9; 21 -1.625,2.9; 22 -2.275,2.9; 23 -2.925,2.9; 24 -3.574,2.903 | smd 8.1 x 3: EXP 0,0
SOT23-DBV = smd 0.55 x 1.2: 1 -0.95,-1.3; 2 0,-1.3; 3 0.95,-1.3; 4 0.95,1.3; 5 -0.95,1.3
DKWM06 = drill 1.1 pad 2.184 octagon: 1 15.24,22.86; 2 10.16,22.86; 3 22.86,2.54; 4 12.7,2.54; 5 2.54,2.54
SO-16W = smd 0.6 x 2.2: 1 -4.445,-4.6; 2 -3.175,-4.6; 3 -1.905,-4.6; 4 -0.635,-4.6; 5 0.635,-4.6; 6 1.905,-4.6; 7 3.175,-4.6; 8 4.445,-4.6; 9 4.445,4.6; 10 3.175,4.6; 11 1.905,4.6; 12 0.635,4.6; 13 -0.635,4.6; 14 -1.905,4.6; 15 -3.175,4.6; 16 -4.445,4.6
RND210-00244 = smd 2.6 x 1.2: 1 -1,7.5; 2 11,2.5; 4 -1,2.5; 8 11,7.5; C -1,5
TBL009-500-02GY-2GY = drill 1.1 pad 2.54 octagon: 1.1 3,2.6; 1.2 3,7.6; 2.1 8,2.6; 2.2 8,7.6

### Placement (x,y rotation side)
C1  29.84,45.09 180 bottom
C2  29.84,42.86 180 bottom
C3  32.07,57.47 90 bottom
C4  34.29,57.47 90 bottom
C5  29.53,57.47 270 bottom
C6  27.3,57.47 270 bottom
C7  29.84,49.53 180 bottom
C8  29.84,47.31 180 bottom
C9  37.78,53.02 90 top
C10  35.56,53.02 90 top
C11  32.38,52.07 180 top
C12  29.84,41.59 0 top
C13  40.01,45.09 180 bottom
C14  40.01,42.86 180 bottom
C15  42.23,57.47 90 bottom
C16  44.45,57.47 90 bottom
C17  39.69,57.47 270 bottom
C18  37.47,57.47 270 bottom
C19  40.01,47.31 180 bottom
C20  40.01,49.53 180 bottom
C21  47.94,53.02 90 top
C22  45.72,53.02 90 top
C23  42.55,52.07 180 top
C24  40.01,41.59 0 top
C25  50.16,42.86 180 bottom
C26  50.16,45.09 180 bottom
C27  52.39,57.47 90 bottom
C28  54.61,57.47 90 bottom
C29  49.85,57.47 270 bottom
C30  47.62,57.47 270 bottom
C31  50.16,47.31 180 bottom
C32  50.16,49.53 180 bottom
C33  58.1,53.02 90 top
C34  55.88,53.02 90 top
C35  52.7,52.07 180 top
C36  50.16,41.59 0 top
C37  60.33,42.86 180 bottom
C38  60.33,45.09 180 bottom
C39  64.77,57.47 90 bottom
C40  62.55,57.47 90 bottom
C41  60.01,57.47 270 bottom
C42  57.78,57.47 270 bottom
C43  60.33,47.31 180 bottom
C44  60.33,49.53 180 bottom
C45  68.26,53.02 90 top
C46  66.04,53.02 90 top
C47  62.87,52.07 180 top
C48  60.33,41.59 0 top
C49  18.1,22.54 270 top
C50  8.57,22.54 90 top
C51  8.57,16.19 90 top
C52  18.1,16.19 270 top
C53  15.88,16.19 270 top
C54  10.79,16.19 90 top
C55  7.62,10.16 180 top
C56  7.62,2.54 180 top
C57  69.53,11.75 90 top
C58  71.12,26.67 270 top
C59  71.12,41.91 270 top
C60  34.92,8.26 0 top
C61  29.53,16.51 0 top
C62  65.09,10.16 0 top
D1  8.89,59.69 90 top
D2  13.65,55.88 90 top
D11  75.56,53.34 90 top
D12  77.79,53.34 90 top
D13  80.01,53.34 90 top
D14  73.34,53.34 90 top
D15  82.23,53.34 90 top
D16  84.45,53.34 90 top
D17  86.68,53.34 90 top
D18  88.9,53.34 90 top
IC1  6.67,6.35 90 top
IC2  78.74,41.91 0 top
IC3  78.74,26.67 0 top
IC5  34.92,12.06 90 top
J1  56.52,5.08 0 top
JP1  26.99,11.43 180 top
JP2  43.81,0.64 180 top
JP3  26.04,0.64 180 top
L1  23.5,23.18 90 top
L2  3.17,23.18 90 top
L4  21.59,60.96 90 top
L5  14.61,61.91 0 top
LED1  97.47,48.9 90 top
LED2  97.47,40.96 90 top
LED3  97.47,33.34 90 top
LED8  97.47,25.72 90 top
OK1  58.42,23.81 90 top
OK2  46.04,23.81 270 top
Q2  65.41,7.3 0 top
R1  62.87,30.8 270 top
R2  60.33,30.8 270 top
R3  57.78,30.8 270 top
R4  55.24,30.8 270 top
R5  53.98,17.78 270 top
R6  56.52,17.78 270 top
R7  59.05,17.78 270 top
R8  61.59,17.78 270 top
R9  50.48,30.8 270 top
R10  47.94,30.8 270 top
R11  45.4,30.8 270 top
R12  42.86,30.8 270 top
R13  93.98,23.18 0 top
R14  93.98,46.35 0 top
R15  93.98,38.42 0 top
R16  93.98,30.8 0 top
R17  93.98,28.26 0 top
R18  19.05,56.52 180 top
R19  93.98,51.44 0 top
R20  93.98,43.5 0 top
R21  93.98,35.88 0 top
R22  95.25,10.48 90 top
R23  93.98,6.35 90 top
R24  92.71,10.48 90 top
R25  91.44,6.35 90 top
R26  90.17,10.48 90 top
R27  88.9,6.35 90 top
R28  87.63,10.48 90 top
R29  86.36,6.35 90 top
R49  62.55,2.22 0 top
R50  26.67,14.29 0 top
U1  76.2,11.75 0 top
U$1  32.07,46.35 0 top
U$2  30.8,57.47 180 top
U$3  0.64,26.99 0 top
U$4  42.23,46.35 0 top
U$5  40.96,57.47 180 top
U$6  52.39,46.35 0 top
U$7  51.12,57.47 180 top
U$8  62.55,46.35 0 top
U$9  61.28,57.47 180 top
U$10  33.34,23.81 0 top
U$19  75.88,56.52 0 top
U$20  75.88,66.67 0 top
X1  25.08,67.31 0 top
X2  35.24,67.31 0 top
X3  45.4,67.31 0 top
X4  55.56,67.31 0 top
X5  13.65,67.31 0 top

### Tracks (layer width: path | path; a pad name or v marks a point on that pad's centre or on a via)
+5V  (via drill 0.2, 0.35, 0.4)
  Top 0.254: U1.4 72.94,12.15 73.34,11.75 73.34,11.43 | 73.34,11.43 73.34,11.11 72.78,10.55 U1.6 69.78,10.55 C57.1 v69.53,9.53 | U1.20 78.74,11.35 | 78.74,11.35 73.42,11.35 73.34,11.43 | U1.18 79.15,9.75 78.74,10.16 78.74,11.35 | OK2.16 50.48,19.37 | 50.48,19.37 47.94,19.37 | 47.94,19.37 OK2.14 | OK2.12 45.4,19.37 | 45.4,19.37 47.94,19.37 | OK2.10 42.86,19.37 45.4,19.37 | U$10.1 28.89,16.82 C61.1 v26.67,16.51 | IC5.8 33.34,10.16 33.98,9.52 C60.1 | J1.2 v53.98,9.53 | R49.2 v65.09,2.22 | v62.23,10.16 C62.1 Q2.4 | C58.1 v73.02,27.62 v73.03,27.62 IC3.20 | C59.1 v73.03,42.86 IC2.20 | 50.48,19.37 v50.48,18.41 | R28.1 v87.63,3.81 | R26.1 v90.17,3.81 | R24.1 v92.71,3.81 | R22.1 v95.25,3.81 | R23.1 v93.98,3.81 | R25.1 v91.44,3.81 | R27.1 v88.9,3.81 | R29.1 v86.36,3.81
  Top 0.508: C60.1 32.38,8.26 JP3.1
  other vias: 14.92,6.35 22.23,13.65 39.69,19.37 52.39,19.37 65.41,20.64 69.22,26.35 71.44,35.88 71.44,46.99 71.44,55.88 70.8,72.07 77.15,76.83 88.9,76.83 99.38,73.98 96.2,76.83 99.38,65.41 99.38,55.88 99.06,15.56 99.06,5.71 93.34,0.64 80.96,0.64 63.82,0.64 55.56,0.64 26.04,0.64 43.81,0.64 60.96,9.21 50.16,9.53 53.02,10.79 49.21,14.61 45.4,14.29 77.47,10.48 74.93,10.48 80.33,16.19 85.41,16.51 88.9,33.66 80.96,48.9 82.87,48.9 85.09,48.9
  pour Route2: 14.29,0 14.29,6.67 17.46,9.84 25.4,17.78 39.05,17.78 39.05,23.5 63.82,23.5 70.17,29.84 70.17,77.47 100.01,77.47 100.01,0
  pour Route15: 14.29,0 14.29,6.67 17.46,9.84 25.4,17.78 39.05,17.78 39.05,23.5 63.82,23.5 70.17,29.84 70.17,77.47 100.01,77.47 100.01,0
+15V  (via drill 0.4)
  Top 0.508: IC1.3 8.65,10.08 C55.1 10.16,10.16 13.02,13.02 13.02,15.88 v14.29,17.14 C53.1 C52.1 C49.+ 18.1,20.95 18.41,21.27 18.51,21.18 L1.1 | U$8.24 57.74,49.26 v57.47,49.53 | U$6.24 47.9,49.26 v47.62,49.53 | U$4.24 37.74,49.26 v37.47,49.53 | U$1.24 27.58,49.26 v27.3,49.53 | v31.75,54.93 U$2.5 | v41.91,54.93 U$5.5 | v52.07,54.93 U$7.5 | v62.23,54.93 U$9.5
  Route15 0.508: v14.29,17.14 18.1,20.95 18.1,42.23 26.35,50.48 | 26.35,50.48 27.3,51.44 31.75,51.44 | 31.75,51.44 37.47,51.44 | 37.47,51.44 41.91,51.44 | 41.91,51.44 47.62,51.44 | 47.62,51.44 52.07,51.44 | 52.07,51.44 57.47,51.44 | 57.47,51.44 v57.47,49.53 | v47.62,49.53 47.62,51.44 | v37.47,49.53 37.47,51.44 | v27.3,49.53 26.35,50.48 | 31.75,51.44 v31.75,54.93 | 41.91,51.44 v41.91,54.93 | 52.07,51.44 v52.07,54.93 | 57.47,51.44 58.74,51.44 v62.23,54.93
  Bottom 0.508: v57.47,49.53 C44.1 C43.1 | C31.1 C32.1 v47.62,49.53 | C19.1 C20.1 v37.47,49.53 | C8.1 C7.1 v27.3,49.53 | v31.75,54.93 31.75,56.2 C3.1 C4.1 | C16.1 C15.1 41.91,56.2 v41.91,54.93 | v52.07,54.93 52.07,56.2 C27.1 C28.1 | v62.23,54.93 62.23,56.2 C40.1 C39.1
-15V  (via drill 0.4)
  Top 0.508: L2.1 3.27,21.27 8.57,21.27 C50.- C51.2 C54.2 10.79,38.42 18.73,46.35 | 18.73,46.35 28.57,46.35 | 28.57,46.35 U$1.EXP | U$1.EXP 38.73,46.35 | 38.73,46.35 U$4.EXP 48.9,46.35 | 48.9,46.35 U$6.EXP 59.37,46.35 | 59.37,46.35 U$8.EXP | U$1.1 28.49,46.27 28.57,46.35 | U$4.1 38.65,45.09 | 38.65,45.09 38.65,46.27 38.73,46.35 | U$6.1 48.81,45.09 | 48.81,45.09 48.81,46.27 48.9,46.35 | U$8.1 58.97,45.09 | 58.97,45.09 58.97,45.95 59.37,46.35 | U$1.EXP 30.8,45.09 v27.3,45.09 | v37.47,45.09 38.65,45.09 | v47.62,45.09 48.81,45.09 | v57.78,45.09 58.97,45.09 | 18.73,46.35 18.73,49.53 v22.86,53.66 | v61.28,60.33 U$9.2 | U$7.2 v51.12,60.33 | U$5.2 v40.96,60.33 | U$2.2 v30.8,60.33
  Bottom 0.508: v27.3,45.09 C1.1 C2.1 | C14.1 C13.1 v37.47,45.09 | C25.1 C26.1 v47.62,45.09 | C37.1 C38.1 v57.78,45.09 | v22.86,53.66 24.77,55.56 24.77,57.47 25.72,58.42 C6.1 C5.1 29.53,60.33 v30.8,60.33 39.69,60.33 | 39.69,60.33 v40.96,60.33 49.85,60.33 | 49.85,60.33 v51.12,60.33 60.01,60.33 | 60.01,60.33 v61.28,60.33 | C42.1 C41.1 60.01,60.33 | C30.1 C29.1 49.85,60.33 | C18.1 C17.1 39.69,60.33
ADR  (via drill 0.3)
  Top 0.254: U1.1 71.18,14.55 70.8,14.92 v70.8,15.24 | v72.39,61.28 72.63,61.52 U$19.C | v72.39,71.44 72.63,71.67 U$20.C
  Route2 0.254: v70.8,15.24 67.31,18.73 67.31,25.72 70.8,29.21 70.8,59.69 v72.39,61.28 v72.39,71.44
AL1  (via drill 0.3)
  Top 0.254: U$1.3 29.79,42.49 29.82,42.46 29.82,39.71 v29.84,39.69 | v41.59,28.26 OK2.8
  Route2 0.254: v29.84,39.69 29.84,34.29 31.43,32.7 37.15,32.7 v41.59,28.26
AL2  (via drill 0.3)
  Top 0.254: U$4.3 39.95,42.49 39.98,42.46 39.98,36.85 v40.01,36.83 | v44.13,28.26 OK2.6
  Route2 0.254: v40.01,36.83 40.01,32.38 v44.13,28.26
AL3  (via drill 0.3)
  Top 0.254: U$6.3 50.11,42.49 50.14,42.46 50.14,36.22 v50.16,36.2 | v46.67,28.26 OK2.4
  Route2 0.254: v50.16,36.2 46.67,32.7 v46.67,28.26
AL4  (via drill 0.3)
  Top 0.254: U$8.3 60.27,42.49 60.3,42.46 60.3,40.3 57.15,37.15 54.29,37.15 v52.39,35.24 | v49.21,28.26 OK2.2
  Route2 0.254: v52.39,35.24 49.21,32.07 v49.21,28.26
AL_CLK  (via drill 0.3)
  Top 0.254: U1.14 77.4,8.82 v77.47,8.89 | v84.45,33.66 IC3.11
  Route2 0.254: v77.47,8.89 82.55,8.89 84.45,10.79 v84.45,33.66
ALARM  (via drill 0.3)
  Top 0.254: U1.9 73.4,8.83 v73.34,8.89 | v73.03,23.5 IC3.1
  Route2 0.254: v73.34,8.89 73.34,23.18 v73.03,23.5
D0  (via drill 0.3)
  Top 0.254: IC3.19 v74.3,34.92 IC2.2 v74.3,39.37 | v73.34,50.16 D14.A | U1.23 79.15,13.75 78.11,12.7 v74.3,12.7 | v74.3,23.5 85.72,23.5 86.36,22.86 R29.2
  Route2 0.254: v74.3,39.37 74.3,49.21 v73.34,50.16 | v74.3,12.7 v74.3,23.5 v74.3,34.92
D1  (via drill 0.3)
  Top 0.254: IC3.18 v75.56,34.92 IC2.3 v75.56,39.37 | v75.56,50.16 D11.A | U1.24 79,14.55 78.11,13.65 v75.56,13.65 | v75.56,24.45 86.04,24.45 87.63,22.86 R28.2
  Route2 0.254: v75.56,39.37 v75.56,50.16 | v75.56,13.65 v75.56,24.45 v75.56,34.92
D2  (via drill 0.3)
  Top 0.254: IC3.17 v76.83,34.92 IC2.4 v76.83,39.37 | v77.79,50.16 D12.A | U1.25 79,15.18 78.42,14.61 v77.79,14.61 | v76.83,25.4 86.04,25.4 88.27,23.18 88.27,13.97 88.9,13.34 R27.2
  Route2 0.254: v76.83,39.37 76.83,49.21 v77.79,50.16 | v77.79,14.61 76.83,15.56 v76.83,25.4 v76.83,34.92
D3  (via drill 0.3)
  Top 0.254: IC3.16 v78.11,34.92 IC2.5 v78.11,39.37 | v80.01,50.16 D13.A | U1.26 78.2,17.66 v78.11,17.76 | v78.11,26.35 86.04,26.35 88.9,23.5 88.9,14.61 90.17,13.34 R26.2
  Route2 0.254: v78.11,39.37 78.11,49.21 79.06,50.16 v80.01,50.16 | v78.11,17.76 v78.11,26.35 v78.11,34.92
D4  (via drill 0.3)
  Top 0.254: v79.38,39.37 IC2.6 v79.38,34.92 | v82.23,50.16 D15.A | U1.27 77.4,18.03 77.79,18.41 79.35,18.41 v79.38,18.39 | v79.38,27.3 86.04,27.3 89.53,23.81 89.53,15.24 91.44,13.34 R25.2
  Route2 0.254: v79.38,39.37 79.38,48.26 81.28,50.16 v82.23,50.16 | v79.38,18.39 v79.38,27.3 v79.38,34.92
D5  (via drill 0.3)
  Top 0.254: v80.64,39.37 IC2.7 v80.64,34.92 | v84.45,50.16 D16.A | U1.28 76.6,18.18 77.47,19.05 v80.64,19.05 | v80.64,28.26 86.04,28.26 90.17,24.13 90.17,15.88 92.71,13.34 R24.2
  Route2 0.254: v80.64,39.37 80.64,47.62 83.19,50.16 v84.45,50.16 | v80.64,19.05 v80.64,28.26 v80.64,34.92
D6  (via drill 0.3)
  Top 0.254: v81.92,39.37 IC2.8 v81.92,34.92 | v86.68,50.16 D17.A | U1.19 81.84,10.55 v81.92,10.48 | v81.92,29.21 86.04,29.21 90.81,24.45 90.81,16.51 93.98,13.34 R23.2
  Route2 0.254: v81.92,39.37 81.92,46.67 85.41,50.16 v86.68,50.16 | v81.92,10.48 v81.92,29.21 v81.92,34.92
D7  (via drill 0.3)
  Top 0.254: v83.19,39.37 IC2.9 v83.19,34.92 | v88.9,50.16 D18.A | U1.22 80.56,13.02 v83.19,13.02 | v83.19,30.15 86.05,30.15 91.44,24.77 91.44,17.14 95.25,13.34 R22.2
  Route2 0.254: v83.19,39.37 83.19,45.72 87.63,50.16 v88.9,50.16 | v83.19,13.02 v83.19,30.15 v83.19,34.92
D+
  Top 0.254: IC5.7 JP1.1 28.26,10.79 26.35,8.89 22.86,8.89 JP3.9
  Route15 0.254: JP3.9 22.23,5.71 37.47,5.71 JP2.9
D-  (via drill 0.3)
  Top 0.254: IC5.6 v30.16,12.7 28.57,14.29 R50.2
  Route2 0.254: JP3.10 22.23,5.71 22.23,7.3 23.81,8.89 28.57,8.89 30.16,10.48 v30.16,12.7
  Route15 0.254: JP3.10 22.23,3.17 37.47,3.17 JP2.10
DIR  (via drill 0.3)
  Top 0.254: IC5.2 IC5.3 v40.64,12.7 | U1.32 73.4,16.14 73.34,16.19 v72.07,16.19
  Route15 0.254: v72.07,16.19 70.8,16.19 67.31,12.7 v40.64,12.7
GND  (via drill 0.2, 0.4)
  Top 0.254: U$10.2 30.16,16.82 C61.2 | U$10.8 v37.78,17.46
  other vias: 14.92,0.64 34.92,0.64 51.44,0.64 60.33,0.64 66.99,0.64 75.56,0.64 86.36,0.64 99.06,0.64 99.06,10.79 99.38,20 99.38,28.57 99.38,35.88 99.38,43.5 99.38,51.44 99.38,60.33 99.38,70.48 99.38,76.83 92.71,76.83 82.87,76.83 70.8,76.83 70.8,66.67 70.8,60.64 71.75,53.34 71.75,45.72 71.44,39.37 71.44,31.11 66.04,24.77 39.69,22.86 52.39,20.64 30.16,14.92 37.47,8.57 59.05,9.84 65.09,11.43 65.09,7.3 70.8,11.75 75.25,12.06 79.06,12.06 71.12,24.13 85.41,21.59 84.45,34.92 64.14,20.64
  pour Bottom: 14.29,0 14.29,6.67 23.5,15.88 25.4,17.78 27.94,17.78 39.05,17.78 39.05,23.5 63.82,23.5 66.36,26.04 70.17,29.84 70.17,41.91 70.17,77.47 100.01,77.47 100.01,0
  pour Top: 14.29,0 14.29,6.67 17.46,9.84 25.4,17.78 39.05,17.78 39.05,23.5 63.82,23.5 70.17,29.84 70.17,77.47 100.01,77.47 100.01,0
GNDIO  (via drill 0.2, 0.4)
  Top 0.254: U$10.15 v30.16,30.48 | U$10.9 37.78,30.16 | C12.2 30.8,38.78 v30.75,38.73
  other vias: 0.64,0.64 6.67,0.64 12.38,0.64 12.38,6.99 14.92,10.16 18.41,13.65 21.91,17.14 25.72,20.95 27.3,24.13 27.3,30.48 33.97,30.48 37.78,30.48 40.01,25.4 45.09,25.4 52.07,25.4 62.55,25.4 65.72,28.26 68.58,31.11 68.58,36.83 68.58,43.81 68.58,49.85 68.58,57.78 68.58,63.5 68.58,70.17 68.58,76.83 19.05,76.83 9.53,76.83 0.64,76.83 0.64,70.48 0.64,63.5 0.64,57.47 0.64,50.48 0.64,43.5 0.64,33.66 0.64,20.64 0.64,11.11 4.76,10.16 4.76,2.54 8.57,13.65 10.79,13.65 14.29,15.24 8.57,26.99 16.51,24.77 37.15,36.2 44.77,35.88 56.52,33.34 59.05,33.34 61.59,33.34 55.88,41.59 46.35,41.59 36.51,41.59 33.97,54.29 39.05,54.29 44.13,54.29 49.21,54.29 54.29,54.29 59.37,54.29 64.45,54.29 62.55,60.33 56.2,57.47 46.04,57.47 35.88,57.47 27.3,54.93 31.75,62.23 41.91,62.23 52.07,62.23
  pour Bottom: 0,0 13.02,0 13.02,7.3 15.88,10.16 26.35,20.64 26.35,21.91 26.35,22.54 27.62,23.81 27.62,29.84 39.05,29.84 39.37,29.53 39.37,24.77 63.18,24.77 66.99,28.57 69.22,30.8 69.22,46.04 69.22,77.47 0,77.47
  pour Route15: 0,0 13.02,0 13.02,7.3 15.88,10.16 26.35,20.64 26.35,21.91 26.35,22.54 27.62,23.81 27.62,29.84 39.05,29.84 39.37,29.53 39.37,24.77 63.18,24.77 66.99,28.57 69.22,30.8 69.22,46.04 69.22,77.47 0,77.47
  pour Route2: 0,0 13.02,0 13.02,7.3 15.88,10.16 26.35,20.64 26.35,21.91 26.35,22.54 27.62,23.81 27.62,29.84 39.05,29.84 39.37,29.53 39.37,24.77 63.18,24.77 66.99,28.57 69.22,30.8 69.22,46.04 69.22,77.47 0,77.47
  pour Top: 0,0 13.02,0 13.02,7.3 15.88,10.16 26.35,20.64 26.35,21.91 26.35,22.54 27.62,23.81 27.62,29.84 39.05,29.84 39.37,29.53 39.37,24.77 63.18,24.77 66.99,28.57 69.22,30.8 69.22,46.04 69.22,77.47 0,77.47
L1  (via drill 0.3)
  Top 0.254: R4.2 v55.24,28.26 OK1.15 | v32.07,37.47 32.07,40.96 32.39,41.28 U$1.7
  Route2 0.254: v55.24,28.26 v55.24,36.2
  Route15 0.254: v55.24,36.2 51.75,36.2 51.12,36.83 41.91,36.83 41.27,37.47 v32.07,37.47
L2  (via drill 0.3)
  Top 0.254: R3.2 v57.78,28.26 OK1.13 | v42.23,37.47 42.23,40.96 42.55,41.28 U$4.7
  Route2 0.254: v57.78,28.26 v57.78,36.83
  Route15 0.254: v57.78,36.83 52.07,36.83 51.44,37.47 v42.23,37.47
L3  (via drill 0.3)
  Top 0.254: R2.2 v60.33,28.26 OK1.11 | v52.39,37.47 52.39,40.96 52.71,41.28 U$6.7
  Route2 0.254: v60.33,28.26 v60.33,37.47
  Route15 0.254: v60.33,37.47 v52.39,37.47
L4  (via drill 0.3)
  Top 0.254: R1.2 v62.87,28.26 OK1.9 | v62.55,37.47 62.55,40.96 62.87,41.28 U$8.7
  Route2 0.254: v62.87,28.26 62.87,37.15 v62.55,37.47
LATCH1  (via drill 0.3)
  Top 0.254: U1.10 74.2,4.67 73.03,3.49 v65.72,3.49 | v53.98,14.92 R5.2
  Route2 0.254: v65.72,3.49 65.72,12.06 64.14,13.65 55.24,13.65 v53.98,14.92
LATCH2  (via drill 0.3)
  Top 0.254: U1.11 75,4.51 73.03,2.54 v66.67,2.54 | v56.52,14.95 R6.2
  Route2 0.254: v66.67,2.54 66.67,12.38 64.75,14.31 57.15,14.31 v56.52,14.95
LATCH3  (via drill 0.3)
  Top 0.254: U1.12 75.8,4.36 73.03,1.59 v67.63,1.59 | v59.05,14.97 R7.2
  Route2 0.254: v67.63,1.59 67.63,12.7 65.36,14.97 v59.05,14.97
LATCH4  (via drill 0.3)
  Top 0.254: U1.13 76.6,4.21 73.03,0.64 v68.58,0.64 | v63.18,16.83 R8.2
  Route2 0.254: v68.58,0.64 68.58,13.02 64.77,16.83 v63.18,16.83
LEDS  (via drill 0.3)
  Top 0.254: U1.2 71.03,13.75 v68.58,16.19 | v85.41,46.67 84.72,46.67 IC2.11
  Bottom 0.254: v68.58,16.19 72.07,19.68 72.07,44.45 74.3,46.67 v85.41,46.67
MISO  (via drill 0.3)
  Top 0.254: J1.1 v53.98,4.13 | v79.06,4.76 79,4.82 U1.16 | U$10.6 35.24,16.19 v36.2,15.24
  Route2 0.254: v36.2,15.24 42.86,15.24 v53.98,4.13
  Route15 0.254: v53.98,4.13 v53.98,4.12 78.42,4.12 v79.06,4.76
MOSI  (via drill 0.3)
  Top 0.254: J1.4 v56.52,6.35 | v77.79,6.03 78.2,6.45 U1.15 | U$10.3 31.43,17.78 v32.7,16.51
  Route2 0.254: v56.52,6.35 56.52,9.53 49.53,16.51 v32.7,16.51
  Route15 0.254: v56.52,6.35 57.15,5.71 77.47,5.71 v77.79,6.03
N$1
  Top 0.254: U$1.15 U$1.14 34.99,50.23 35.24,50.48 37.47,50.48 37.78,50.8 C9.1
N$2
  Top 0.254: U$1.18 32.39,53.03 32.7,53.34 34.29,53.34 C10.1
N$3
  Top 0.254: U$1.17 33.04,51.78 C11.1
N$4
  Top 0.254: 41.9,51.76 C23.2 | U$4.21 40.6,50.13 40.96,50.48 41.9,50.48
  Top 0.406: U$4.19 41.9,50.48 41.9,51.76 | C23.2 41.59,53.34 43.18,54.93
  Top 0.508: U$5.3 40.01,63.78 43.24,67.02 | X2.2.2 X2.2.1 43.24,67.02 | 43.18,54.93 43.24,54.99 43.24,67.02
N$5
  Top 0.254: 31.74,51.76 C11.2 | U$1.21 30.44,50.13 30.8,50.48 31.74,50.48
  Top 0.406: U$1.19 31.74,50.48 31.74,51.76 | C11.2 31.43,53.34 33.02,54.93
  Top 0.508: U$2.3 29.85,63.78 33.08,67.02 | 33.08,67.02 X1.2.1 X1.2.2 | 33.02,54.93 33.08,54.99 33.08,67.02
N$6
  Top 0.254: U$2.1 31.75,58.42 29.85,56.52 U$2.4 29.79,56.11 U$1.22
N$7
  Top 0.254: U$5.1 41.91,58.42 40.01,56.52 U$5.4 39.95,56.11 U$4.22
N$8
  Top 0.254: U$4.15 U$4.14 45.15,50.23 45.4,50.48 47.62,50.48 47.94,50.8 C21.1
N$9
  Top 0.254: U$4.18 42.55,53.03 42.86,53.34 44.45,53.34 C22.1
N$10
  Top 0.254: U$4.17 43.2,51.78 C23.1
N$11
  Top 0.254: 52.06,51.76 C35.2 | U$6.21 50.76,50.13 51.12,50.48 52.06,50.48
  Top 0.406: U$6.19 52.06,50.48 52.06,51.76 | C35.2 51.76,53.34 53.34,54.93
  Top 0.508: U$7.3 50.17,63.78 53.4,67.02 | X3.2.2 X3.2.1 53.4,67.02 | 53.34,54.93 53.4,54.99 53.4,67.02
N$12
  Top 0.254: U$6.22 50.11,56.11 U$7.4 50.17,56.52 52.07,58.42 U$7.1
N$13
  Top 0.254: U$6.15 U$6.14 55.31,50.23 55.56,50.48 57.78,50.48 58.1,50.8 C33.1
N$14
  Top 0.254: U$6.18 52.71,53.03 53.02,53.34 54.61,53.34 C34.1
N$15
  Top 0.254: U$6.17 53.36,51.78 C35.1
N$16
  Top 0.254: 62.22,51.76 C47.2 | U$8.21 60.92,50.13 61.28,50.48 62.22,50.48
  Top 0.406: U$8.19 62.22,50.48 62.22,51.76 | C47.2 61.91,53.34 63.5,54.93
  Top 0.508: U$9.3 60.33,63.78 63.56,67.02 | X4.2.2 X4.2.1 63.56,67.02 | 63.5,54.93 63.56,54.99 63.56,67.02
N$17
  Top 0.254: U$8.22 60.27,56.11 U$9.4 60.33,56.52 62.23,58.42 U$9.1
N$18
  Top 0.254: U$8.15 U$8.14 65.47,50.23 65.72,50.48 67.94,50.48 68.26,50.8 C45.1
N$19
  Top 0.254: U$8.18 62.87,53.03 63.18,53.34 64.77,53.34 C46.1
N$20
  Top 0.254: U$8.17 63.52,51.78 C47.1
N$21
  Top 1.016: X5.2.2 X5.2.1 21.65,63.02 L4.2
N$22
  Top 1.016: X5.1.2 X5.1.1 16.65,61.96 L5.2
N$23
  Top 0.508: L4.1 R18.1
N$24
  Top 0.508: R18.2 15.35,57.68 D2.A 8.91,57.68 D1.C
N$25
  Top 0.508: L5.1 9.07,61.91 D1.A 6.17,61.73 5.08,60.64 5.08,55.56 U$3.2
N$26
  Top 0.508: D2.C 13.65,52.07 U$3.1
N$27
  Top 0.508: L1.2 U$3.3
N$28
  Top 0.508: L2.2 U$3.5
N$29  (via drill 0.3)
  Top 0.254: R13.1 v93.03,24.76 v93.03,24.77 | v74.93,40.32 74.3,40.96 IC2.19
  Route15 0.254: v93.03,24.77 85.72,32.07 85.72,38.42 83.82,40.32 v74.93,40.32
N$30  (via drill 0.3)
  Top 0.254: R14.1 v91.44,46.35 | v76.2,44.13 75.56,44.77 IC2.18
  Route15 0.254: v76.2,44.13 89.22,44.13 v91.44,46.35
N$31  (via drill 0.3)
  Top 0.254: R15.1 v91.44,38.42 | v77.47,42.86 76.83,43.5 IC2.17
  Route15 0.254: v91.44,38.42 89.53,38.42 85.09,42.86 v77.47,42.86
N$32  (via drill 0.3)
  Top 0.254: R16.1 v91.44,30.8 | v78.74,41.59 78.11,42.23 IC2.16
  Route15 0.254: v91.44,30.8 88.9,30.8 87,32.7 87,39.05 84.45,41.59 v78.74,41.59
N$33
  Top 0.254: R9.2 OK2.1
N$34
  Top 0.254: OK1.1 R5.1
N$35
  Top 0.254: OK1.3 R6.1
N$36
  Top 0.254: R7.1 OK1.5
N$37
  Top 0.254: R8.1 OK1.7
N$38
  Top 0.254: R10.2 OK2.3
N$39
  Top 0.254: R11.2 OK2.5
N$40
  Top 0.254: R12.2 OK2.7
N$41  (via drill 0.3)
  Top 0.254: R17.1 v91.44,28.26 | v80.01,40.96 79.38,41.59 IC2.15
  Route15 0.254: v91.44,28.26 90.49,28.26 86.36,32.38 86.36,38.73 84.14,40.96 v80.01,40.96
N$42  (via drill 0.3)
  Top 0.254: R19.1 v91.44,51.44 | v81.28,44.77 80.64,45.4 IC2.14
  Route15 0.254: v81.28,44.77 84.77,44.77 v91.44,51.44
N$43  (via drill 0.3)
  Top 0.254: R20.1 v91.44,43.5 | v82.55,43.5 81.92,44.13 IC2.13
  Route15 0.254: v91.44,43.5 v82.55,43.5
N$44  (via drill 0.3)
  Top 0.254: R21.1 v91.44,35.88 | v83.82,42.23 83.19,42.86 IC2.12
  Route15 0.254: v91.44,35.88 88.58,35.88 87.63,36.83 87.63,39.37 84.77,42.23 v83.82,42.23
N$45
  Top 0.254: LED8.1 R13.2
N$46
  Top 0.254: LED1.1 R14.2
N$47
  Top 0.254: LED2.1 R15.2
N$48
  Top 0.254: LED3.1 R16.2
N$49
  Top 0.254: LED8.3 R17.2
N$50
  Top 0.254: LED1.3 R19.2
N$51
  Top 0.254: LED2.3 R20.2
N$52
  Top 0.254: LED3.3 R21.2
N$53  (via drill 0.3)
  Top 0.254: OK2.9 v41.59,21.59 | v68.26,23.56 68.26,21.59 71.75,18.1 75.56,18.1 78.11,20.64
  Top 0.61: 78.11,20.64 IC3.5
  Route15 0.254: v41.59,21.59 43.57,23.57 v68.26,23.57 v68.26,23.56
N$54  (via drill 0.3)
  Top 0.254: OK2.11 v44.13,21.59 | v69.22,22.91 69.22,21.59 72.12,18.68 75.2,18.68 76.83,20.32 IC3.4
  Route15 0.254: v69.22,22.91 45.45,22.91 v44.13,21.59
N$55  (via drill 0.3)
  Top 0.254: OK2.13 v46.67,21.59 | v70.17,22.25 70.17,21.59 72.39,19.37 74.61,19.37 75.56,20.32 IC3.3
  Route15 0.254: v46.67,21.59 47.33,22.25 v70.17,22.25
N$56  (via drill 0.3)
  Top 0.254: OK2.15 v49.21,21.59 | v71.12,21.59 72.71,20 73.98,20 74.3,20.32 IC3.2
  Route15 0.254: v49.21,21.59 v71.12,21.59
N$97
  Top 0.254: U1.7 71.03,9.75 69.68,8.4 Q2.3
N$99
  Top 0.254: R50.1 JP1.2
N$100
  Top 0.254: D14.C 73.34,56.52 71.44,58.42 71.44,62.87 72.59,64.02 U$19.1
N$101  (via drill 0.3)
  Top 0.254: D11.C v75.56,56.2 | U$19.2 84.81,59.02 v84.77,59.05
  Route15 0.254: v75.56,56.2 81.92,56.2 v84.77,59.05
N$102
  Top 0.254: D12.C 77.79,58.1 76.83,59.05 74.92,59.05 U$19.4
N$103  (via drill 0.3)
  Top 0.254: D13.C v80.01,56.85 | v84.77,63.82 84.97,64.02 U$19.8
  Route15 0.254: v80.01,56.85 80.01,59.05 v84.77,63.82
N$104
  Top 0.254: D15.C 82.23,73.34 81.28,74.3 75,74.3 U$20.1
N$105
  Top 0.254: D16.C 84.45,56.52 83.82,57.15 83.82,67.94 85.05,69.17 U$20.2
N$106  (via drill 0.3)
  Top 0.254: D17.C v86.68,56.52 | v74.93,67.63 74.88,67.67 U$20.4
  Route2 0.254: v86.68,56.52 85.72,56.52 74.93,67.31 v74.93,67.63
N$107
  Top 0.254: D18.C 88.9,73.66 88.58,73.98 87.08,73.98 U$20.8
RESET  (via drill 0.3)
  Top 0.254: J1.5 R49.1 v61.6,6.67 v61.59,6.67 | v76.52,14.29 75.8,15.01 U1.29
  Route15 0.254: v61.59,6.67 73.66,6.67 76.52,9.53 v76.52,14.29
RXD  (via drill 0.3)
  Top 0.254: U1.30 75,16.76 74.61,17.14 v72.07,17.14 | IC5.1 40.64,10.16 42.23,11.75 v42.23,13.34
  Route15 0.254: v72.07,17.14 70.8,17.14 66.99,13.34 v42.23,13.34
SCK  (via drill 0.3)
  Top 0.254: J1.3 v56.52,5.08 | v80.33,7.3 80.33,8.78 U1.17 | U$10.4 32.7,17.78 v34.61,15.88
  Route2 0.254: v34.61,15.88 45.72,15.88 v56.52,5.08
  Route15 0.254: v56.52,5.08 78.11,5.08 v80.33,7.3
SCLK  (via drill 0.3)
  Top 0.254: U$10.13 v32.7,39.05 32.7,40.64 33.04,40.98 U$1.8 | v42.86,39.05 42.86,40.64 43.2,40.98 U$4.8 | v53.02,39.05 53.02,40.64 53.36,40.98 U$6.8 | v63.18,39.05 63.18,40.64 63.52,40.98 U$8.8
  Route15 0.254: v32.7,39.05 v42.86,39.05 v53.02,39.05 v63.18,39.05
SDI  (via drill 0.3)
  Top 0.254: U$10.14 v31.43,40.01 | U$1.9 33.69,40.04 v33.66,40.01 | U$4.9 43.85,40.04 v43.81,40.01 | U$6.9 54.01,40.04 v53.98,40.01 | U$8.9 64.17,40.04 v64.14,40.01
  Route15 0.254: v31.43,40.01 v33.66,40.01 v43.81,40.01 v53.98,40.01 v64.14,40.01
SDO  (via drill 0.3)
  Top 0.254: U$10.11 v35.24,38.1 35.24,40.32 34.34,41.22 U$1.10 | U$4.10 44.5,40.91 44.77,40.64 v44.77,38.1 | v54.93,38.1 54.93,40.64 54.66,40.91 U$6.10 | v65.09,38.1 65.09,40.64 64.82,40.91 U$8.10
  Route15 0.254: v35.24,38.1 v44.77,38.1 v54.93,38.1 v65.09,38.1
TXD  (via drill 0.3)
  Top 0.254: U1.31 74.2,15.33 v74.93,14.61 | v43.81,12.06 43.81,13.02 42.86,13.97 IC5.4
  Route15 0.254: v74.93,14.61 70.17,14.61 67.63,12.06 v43.81,12.06
VCC  (via drill 0.4)
  Top 0.254: U$1.2 29.14,41.84 C12.1 | U$4.2 39.3,41.84 C24.1 | U$6.2 49.46,41.84 C36.1 | U$8.2 59.62,41.84 C48.1 | OK1.16 53.98,26.99 53.98,25.72 56.52,25.72 | 56.52,25.72 59.05,25.72 | 59.05,25.72 61.59,25.72 OK1.10 | OK1.12 59.05,25.72 | OK1.14 56.52,25.72
  Top 0.508: IC1.1 8.65,2.62 C56.1 v10.48,2.54 | v52.7,27.3 53.02,26.99 53.98,26.99 | R12.1 R11.1 R10.1 R9.1 v52.7,31.75 | U$10.16 v28.89,34.92 v28.89,34.93 C12.1 | C24.1 v39.05,34.93 v39.05,34.92 | C36.1 49.22,36.83 v47.31,34.92 | C48.1 v57.47,41.59
  Route2 0.508: v57.47,41.59 57.47,39.37 55.24,37.15 54.29,37.15 53.66,36.51 53.66,32.7 v52.7,31.75
  Route15 0.508: v10.48,2.54 10.48,8.57 26.35,24.45 26.35,32.38 v28.89,34.92 v39.05,34.92 v47.31,34.92 50.48,34.92 52.7,32.7 v52.7,31.75 v52.7,27.3

### Text on the board
Top: SynPLC / AO4-1 V1 / 22.07.20 / Marco Müller